# Altium schematic sheet Prac_1.SchDoc
size A3
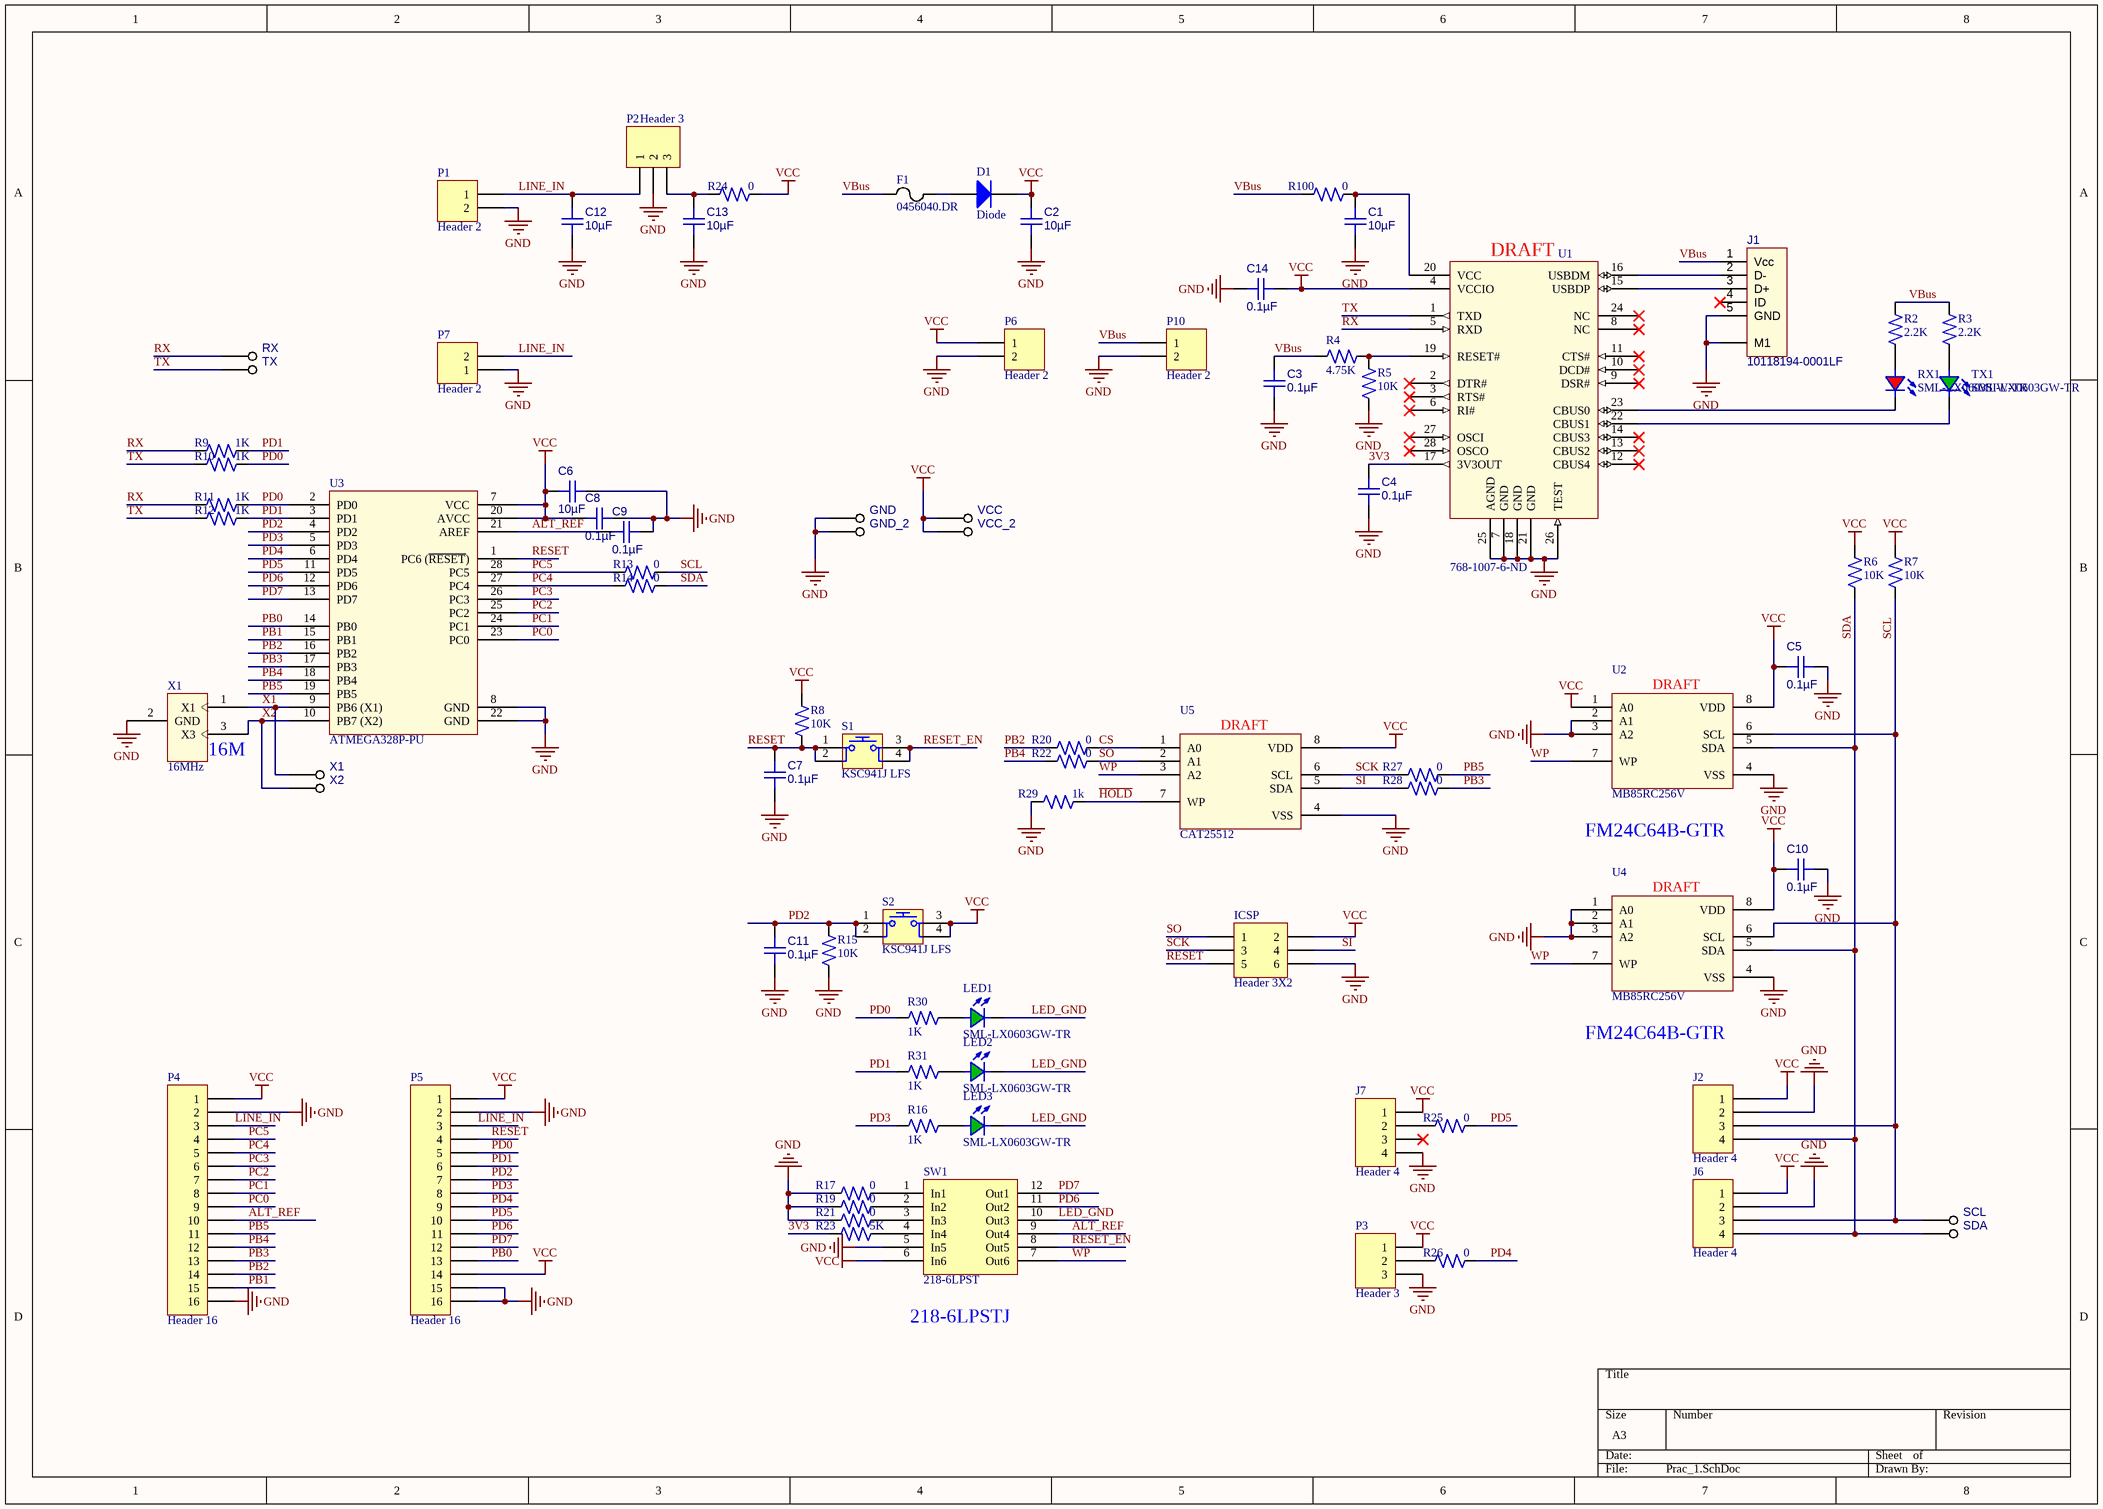
[diagram p0: Prac_1.SchDoc]

## Parts
(Parts that share a designator on the sheet are numbered #1, #2 ... from top to bottom, then left to right.)
C1  10µF  [C0603(0.8)]
C2  10µF  [C0603(0.8)]
C3  0.1µF  [C0603(0.8)]
C4  0.1µF  [C0603(0.8)]
C5  0.1µF  [C0603(0.8)]
C6  10µF  [C0603(0.8)]
C7  0.1µF  [C0603(0.8)]
C8  0.1µF  [C0603(0.8)]
C9  0.1µF  [C0603(0.8)]
C10  0.1µF  [C0603(0.8)]
C11  0.1µF  [C0603(0.8)]
C12  10µF  [C0603(0.8)]
C13  10µF  [C0603(0.8)]
C14  0.1µF  [C0603(0.8)]
D1  Diode  [R0402(0.4)]
F1  0456040.DR  [R0402(0.4)]
GND  Test_Pad  [TP-30X50]  (value not drawn)  (no BOM)
GND_2  Test_Pad  [TP-30X50]  (value not drawn)  (no BOM)
ICSP  Header 3X2  [HDR2X3]
J1  10118194-0001LF  [10118194-0001LF[1]]
J2  Header 4  [HDR1X4]
J6  Header 4  [HDR1X4]
J7  Header 4  [HDR1X4]
LED1  SML-LX0603GW-TR  [SML-LX0603GW-TR]
LED2  SML-LX0603GW-TR  [SML-LX0603GW-TR]
LED3  SML-LX0603GW-TR  [SML-LX0603GW-TR]
P1  Header 2  [jack]
P2  Header 3  [TO-220-3]
P3  Header 3  [HDR1X3]
P4  Header 16  [HDR1X16]
P5  Header 16  [HDR1X16]
P6  Header 2  [HDR1X2]
P7  Header 2  [HDR1X2]
P10  Header 2  [HDR1X2]
R2  2.2K  [R0402(0.4)]
R3  2.2K  [R0402(0.4)]
R4  4.75K  [R0402(0.4)]
R5  10K  [R0402(0.4)]
R6  10K  [R0402(0.4)]
R7  10K  [R0402(0.4)]
R8  10K  [R0402(0.4)]
R9  1K  [R0402(0.4)]
R10  1K  [R0402(0.4)]
R11  1K  [R0402(0.4)]
R12  1K  [R0402(0.4)]
R13  0  [R0402(0.4)]
R14  0  [R0402(0.4)]
R15  10K  [R0402(0.4)]
R16  1K  [R0402(0.4)]
R17  0  [R0402(0.4)]
R19  0  [R0402(0.4)]
R20  0  [R0402(0.4)]
R21  0  [R0402(0.4)]
R22  0  [R0402(0.4)]
R23  5K  [R0402(0.4)]
R24  0  [R0402(0.4)]
R25  0  [R0402(0.4)]
R26  0  [R0402(0.4)]
R27  0  [R0402(0.4)]
R28  0  [R0402(0.4)]
R29  1k  [R0402(0.4)]
R30  1K  [R0402(0.4)]
R31  1K  [R0402(0.4)]
R100  0  [R0402(0.4)]
RX  Test_Pad  [TP-30X50]  (value not drawn)  (no BOM)
RX1  SML-LX0603SIW-TR  [SML-LX0603SIW-TR]
S1  KSC941J LFS  [KSC9(6.5,6.5,7.9)[1]]
S2  KSC941J LFS  [KSC9(6.5,6.5,7.9)[1]]
SCL  Test_Pad  [TP-30X50]  (value not drawn)  (no BOM)
SDA  Test_Pad  [TP-30X50]  (value not drawn)  (no BOM)
SW1  218-6LPST  [218-6LPST]
TX  Test_Pad  [TP-30X50]  (value not drawn)  (no BOM)
TX1  SML-LX0603GW-TR  [SML-LX0603GW-TR]
U1  768-1007-6-ND  [28-SSOP]
U2  MB85RC256V  [MB85RC256V]
U3  ATMEGA328P-PU  [dip28]
U4  MB85RC256V  [MB85RC256V]
U5  CAT25512  [MB85RC256V]
VCC  Test_Pad  [TP-30X50]  (value not drawn)  (no BOM)
VCC_2  Test_Pad  [TP-30X50]  (value not drawn)  (no BOM)
X1#1  16MHz  [ZTT16.00MX]
X1#2  Test_Pad  [TP-30X50]  (value not drawn)  (no BOM)
X2  Test_Pad  [TP-30X50]  (value not drawn)  (no BOM)

## Nets
GND: C1.1 C2.1 C3.1 C4.1 C5.2 C6.1 C7.1 C8.2 C9.2 C10.2 C11.1 C12.1 C13.1 C14.1 GND.1 GND_2.1 ICSP.6 J1.5(GND) J1.M1 J2.2 J6.2 J7.4 P1.2 P2.2 P3.3 P4.2 P4.16 P5.2 P5.15 P5.16 P6.2 P7.1 P10.2 R5.1 R15.1 R17.1 R19.1 R21.1 R29.1 SW1.5(In5) U1.7(GND) U1.18(GND) U1.21(GND) U1.25(AGND) U1.26(TEST) U2.2(A1) U2.3(A2) U2.4(VSS) U3.8(GND) U3.22(GND) U4.1(A0) U4.2(A1) U4.3(A2) U4.4(VSS) U5.4(VSS) X1#1.2(GND)
VCC: C2.2 C5.1 C6.2 C8.1 C10.1 C14.2 D1.2(K) ICSP.2 J2.1 J6.1 J7.1 P3.1 P4.1 P5.1 P5.14 P6.1 R6.2 R7.2 R8.2 R24.2 S2.3 S2.4 SW1.6(In6) U1.4(VCCIO) U2.1(A0) U2.8(VDD) U3.7(VCC) U3.20(AVCC) U4.8(VDD) U5.8(VDD) VCC.1 VCC_2.1
3V3: C4.2 R23.1 U1.17(3V3OUT)
ALT_REF: C9.1 P4.10 SW1.9(Out4) U3.21(AREF)
CS: R20.2 U5.1(A0)
~{HOLD}: R29.2 U5.7(WP)
LED_GND: LED1.2(K) LED2.2(K) LED3.2(K) SW1.10(Out3)
LINE_IN: C12.2 P1.1 P2.1 P4.3 P5.3 P7.2
PB0: P5.13 U3.14(PB0)
PB1: P4.15 U3.15(PB1)
PB2: P4.14 R20.1 U3.16(PB2)
PB3: P4.13 R28.2 U3.17(PB3)
PB4: P4.12 R22.1 U3.18(PB4)
PB5: P4.11 R27.2 U3.19(PB5)
PC0: P4.9 U3.23(PC0)
PC1: P4.8 U3.24(PC1)
PC2: P4.7 U3.25(PC2)
PC3: P4.6 U3.26(PC3)
PC4: P4.5 R14.1 U3.27(PC4)
PC5: P4.4 R13.1 U3.28(PC5)
PD0: P5.5 R10.2 R11.2 R30.1 U3.2(PD0)
PD1: P5.6 R9.2 R12.2 R31.1 U3.3(PD1)
PD2: C11.2 P5.7 R15.2 S2.1 S2.2 U3.4(PD2)
PD3: P5.8 R16.1 U3.5(PD3)
PD4: P5.9 R26.2 U3.6(PD4)
PD5: P5.10 R25.2 U3.11(PD5)
PD6: P5.11 SW1.11(Out2) U3.12(PD6)
PD7: P5.12 SW1.12(Out1) U3.13(PD7)
RESET: C7.2 ICSP.5 P5.4 R8.1 S1.1 S1.2 U3.1(PC6_(~{RESET}))
RESET_EN: S1.3 S1.4 SW1.8(Out5)
RX: R9.1 R11.1 RX.1 U1.5(RXD)
SCK: ICSP.3 R27.1 U5.6(SCL)
SCL: J2.3 J6.3 R7.1 R13.2 SCL.1 U2.6(SCL) U4.6(SCL)
SDA: J2.4 J6.4 R6.1 R14.2 SDA.1 U2.5(SDA) U4.5(SDA)
SI: ICSP.4 R28.1 U5.5(SDA)
SO: ICSP.1 R22.2 U5.2(A1)
TX: R10.1 R12.1 TX.1 U1.1(TXD)
VBus: C3.2 F1.1 J1.1(Vcc) P10.1 R2.2 R3.2 R4.1 R100.1
WP: SW1.7(Out6) U2.7(WP) U4.7(WP) U5.3(A2)
X1: U3.9(PB6_(X1)) X1#1.1(X1) X1#2.1
X2: U3.10(PB7_(X2)) X1#1.3(X3) X2.1
NetC1_2: C1.2 R100.2 U1.20(VCC)
NetC13_2: C13.2 P2.3 R24.1
NetD1_1: D1.1(A) F1.2
NetJ1_2: J1.2(D-) U1.16(USBDM)
NetJ1_3: J1.3(D+) U1.15(USBDP)
NetJ7_2: J7.2 R25.1
NetLED1_1: LED1.1(A) R30.2
NetLED2_1: LED2.1(A) R31.2
NetLED3_1: LED3.1(A) R16.2
NetP3_2: P3.2 R26.1
NetR2_1: R2.1 RX1.1(A)
NetR3_1: R3.1 TX1.1(A)
NetR4_2: R4.2 R5.2 U1.19(RESET#)
NetR17_2: R17.2 SW1.1(In1)
NetR19_2: R19.2 SW1.2(In2)
NetR21_2: R21.2 SW1.3(In3)
NetR23_2: R23.2 SW1.4(In4)
NetRX1_2: RX1.2(K) U1.23(CBUS0)
NetTX1_2: TX1.2(K) U1.22(CBUS1)

Not connected (* = marked no-connect by the designer): J1 4(ID)*; J7 3*; U1 2(DTR#)* 3(RTS#)* 6(RI#)* 8(NC)* 9(DSR#)* 10(DCD#)* 11(CTS#)* 12(CBUS4)* 13(CBUS2)* 14(CBUS3)* 24(NC)* 27(OSCI)* 28(OSCO)*

## Notes on the sheet
- FM24C64B-GTR
- (near SW1) 218-6LPSTJ
- (in symbol FT232RL) DRAFT
- (in symbol MB85RC256V) DRAFT
- (in symbol ZTT16.00MX) 16M

## Library data of the parts
C1 C2 C6 C12 C13 = C1608X5R1E106M080AC: CAP CER 10µF 25V X5R 0603; Manufacturer: TDK Corporation; Tolerance: ±20%; Sub Category: Ceramic Capacitors; Case: 0603; Temperature Coefficient: X5R; Voltage - Rated: 25V; Manufacturer Part Number: C1608X5R1E106M080AC; Category: Capacitors; Part Status: Active; Series: C; Capacitance: 10µF; Operating Temperature: -55°C ~ 85°C; Features: Low ESL; Applications: General Purpose; Mounting Type: Surface Mount, MLCC; Package / Case: 0603 (1608 Metric); Size / Dimension: 0.063" L x 0.032" W (1.60mm x 0.80mm); Thickness (Max): 0.039" (1.00mm); ComponentLink1Description: Datasheet - Mfg. site; ComponentLink1URL: https://product.tdk.com/info/en/catalog/datasheets/mlcc_commercial_general_en.pdf; Supplier 1: Digi-Key; Supplier Part Number 1: 445-9015-1-ND
C3-C5 C7-C11 C14 = GRM188R71H104KA93D: CAP CER 0.1µF 50V X7R 0603; Manufacturer: Murata Electronics North America; Tolerance: ±10%; Sub Category: Ceramic Capacitors; Case: 0603; Temperature Coefficient: X7R; Voltage - Rated: 50V; Manufacturer Part Number: GRM188R71H104KA93D; Category: Capacitors; Part Status: Active; Series: GRM; Capacitance: 0.1µF; Operating Temperature: -55°C ~ 125°C; Applications: General Purpose; Mounting Type: Surface Mount, MLCC; Package / Case: 0603 (1608 Metric); Size / Dimension: 0.063" L x 0.032" W (1.60mm x 0.80mm); Thickness (Max): 0.035" (0.90mm); ComponentLink1Description: Datasheet - Mfg. site; ComponentLink1URL: http://www.murata.com/~/media/webrenewal/support/library/catalog/products/capacitor/mlcc/c02e.ashx?la=en-us; Supplier 1: Digi-Key; Supplier Part Number 1: 490-1519-1-ND
D1 = Diode: Default Diode; Published: 8-Jun-2000; LatestRevisionDate: 17-Jul-2002; LatestRevisionNote: Re-released for DXP Platform.; PackageVersion: Sep-1996; PackageReference: SMC; Publisher: Altium Limited; PackageDescription: DO-214-AB/SMC; 2 C-Bend Leads; Body 7.9 x 5.9 mm, inc. leads (LxW); Code_JEDEC: DO-214-AB
F1 = 0456040.DR: Imported; Vendor: Littelfuse Inc; Built_By: EMA_UL_Team; Type: DEV; C: Copyright (C) 2015 Accelerated Designs. All rights reserved; Manufacturer_Part_Number: 0456040.DR; RefDes: RefDes; Value: Value
GND GND_2 RX SCL SDA TX VCC VCC_2 X1#2 X2 = TP30x50: TP 30X50; Categories: Miscellaneous; Sub Category: Test Pads; Detailed Description: Test Pad 30x50; Manufacturer Part Number: TP30x50
ICSP = Header 3X2: Header, 3-Pin, Dual row; LatestRevisionDate: 17-Jul-2002; LatestRevisionNote: Re-released for DXP Platform.; Publisher: Altium Limited
J1 = 10118194-0001LF: CONN RCPT USB2.0 MICRO B SMD R/A; Manufacturer: Amphenol FCI; Sub Category: USB, DVI, HDMI Connectors; Detailed Description: USB - micro B USB 2.0 Receptacle Connector 5 Position Surface Mount, Right Angle; Through Hole; Connector Type: USB - micro B; Gender: Receptacle; Number of Contacts: 5; Current Rating: 1.8A per Contact; Voltage Rating: 100VAC; Shielding: Shielded; Mating Cycles: 10000; Material Flammability Rating: UL94 V-0; Manufacturer Part Number: 10118194-0001LF; Category: Connectors, Interconnects; Part Status: Active; Specifications: USB 2.0; Mounting Type: Surface Mount, Right Angle; Through Hole; Mounting Feature: Horizontal; Termination: Solder; Features: Solder Retention; Contact Finish: Gold; Insulation Color: Black; Shell/Shielding Material: Steel, Stainless; Operating Temperature: -30°C ~ 80°C; ComponentLink1Description: Datasheet - Mfg. site; ComponentLink1URL: http://www.amphenol-icc.com/media/wysiwyg/files/drawing/10118194.pdf; Supplier 1: Digi-Key; Supplier Part Number 1: 609-4618-1-ND
J2 J6 J7 = Header 4: Header, 4-Pin; LatestRevisionDate: 17-Jul-2002; LatestRevisionNote: Re-released for DXP Platform.; Publisher: Altium Limited
LED1-LED3 TX1 = SML-LX0603GW-TR: LED GREEN DIFFUSED SMD; Manufacturer: Lumex Opto/Components Inc.; Sub Category: LED Indication - Discrete; Detailed Description: Green  LED Indication - Discrete 2.2V 0603 (1608 Metric); Configuration: Standard; Lens Color: White; Millicandela Rating: 18mcd; Lens Style: Rectangle with Flat Top; Lens Size: 1.00mm x 0.80mm; Voltage - Forward (Vf) (Typ): 2.2V; Current - Test: 20mA; Viewing Angle: 160°; Manufacturer Part Number: SML-LX0603GW-TR; Category: Optoelectronics; Part Status: Active; Color: Green; Lens Transparency: Diffused; Mounting Type: Surface Mount; Package / Case: 0603 (1608 Metric); Size / Dimension: 1.60mm L x 0.80mm W; Height (Max): 0.60mm; ComponentLink1Description: Datasheet - Mfg. site; ComponentLink1URL: https://www.lumex.com/content/files/ProductAttachment/SML-LX0603GW-TR.pdf; Supplier 1: Digi-Key; Supplier Part Number 1: 67-1549-1-ND
P1 P6 P7 P10 = Header 2: Header, 2-Pin; LatestRevisionDate: 17-Jul-2002; LatestRevisionNote: Re-released for DXP Platform.; Publisher: Altium Limited
P2 P3 = Header 3: Header, 3-Pin; LatestRevisionDate: 17-Jul-2002; LatestRevisionNote: Re-released for DXP Platform.; Publisher: Altium Limited
P4 P5 = Header 16: Header, 16-Pin; LatestRevisionDate: 17-Jul-2002; LatestRevisionNote: Re-released for DXP Platform.; Publisher: Altium Limited
R2 R3 = ERJ-PA2F2201X: RES SMD 2.2K OHM 1% 1/5W 0402; Manufacturer: Panasonic Electronic Components; Sub Category: Chip Resistor - Surface Mount; Resistance: 2.2 kOhms; Power (Watts): 0.2W, 1/5W; Temperature Coefficient: ±100ppm/°C; Manufacturer Part Number: ERJ-PA2F2201X; Category: Resistor; Part Status: Active; Series: ERJ; Value: 2.2K; Tolerance: ±1%; Composition: Thick Film; Operating Temperature: -55°C ~ 155°C; Features: Automotive AEC-Q200, Pulse Withstanding; Package / Case: 0402 (1005 Metric); Case: 0402; Supplier Device Package: 0402; Size / Dimension: 0.039" L x 0.020" W (1.00mm x 0.50mm); Height - Seated (Max): 0.016" (0.40mm); ComponentLink1Description: Datasheet - Mfg. site; ComponentLink1URL: https://industrial.panasonic.com/cdbs/www-data/pdf/RDO0000/AOA0000C331.pdf; Supplier 1: Digi-Key; Supplier Part Number 1: P17226CT-ND
R4 = AC0402FR-074K75L: RES SMD 4.75K OHM 1% 1/16W 0402; Manufacturer: Yageo; Sub Category: Chip Resistor - Surface Mount; Resistance: 4.75 kOhms; Power (Watts): 0.063W, 1/16W; Temperature Coefficient: ±100ppm/°C; Manufacturer Part Number: AC0402FR-074K75L; Category: Resistor; Part Status: Active; Series: AC; Value: 4.75K; Tolerance: ±1%; Composition: Thick Film; Operating Temperature: -55°C ~ 155°C; Features: Automotive AEC-Q200, Moisture Resistant; Package / Case: 0402 (1005 Metric); Case: 0402; Supplier Device Package: 0402; Size / Dimension: 0.039" L x 0.020" W (1.00mm x 0.50mm); Height - Seated (Max): 0.015" (0.37mm); ComponentLink1Description: Datasheet - Mfg. site; ComponentLink1URL: http://www.yageo.com/NewPortal/yageodocoutput?fileName=/pdf/R-Chip/PYu-AC_51_RoHS_L_6.pdf; Supplier 1: Digi-Key; Supplier Part Number 1: YAG3496CT-ND
R5 R8 R15 = AC0402FR-0710KL: RES SMD 10K OHM 1% 1/16W 0402; Manufacturer: Yageo; Sub Category: Chip Resistor - Surface Mount; Resistance: 10 kOhms; Power (Watts): 0.063W, 1/16W; Temperature Coefficient: ±100ppm/°C; Manufacturer Part Number: AC0402FR-0710KL; Category: Resistor; Part Status: Active; Series: AC; Value: 10K; Tolerance: ±1%; Composition: Thick Film; Operating Temperature: -55°C ~ 155°C; Features: Automotive AEC-Q200, Moisture Resistant; Package / Case: 0402 (1005 Metric); Case: 0402; Supplier Device Package: 0402; Size / Dimension: 0.039" L x 0.020" W (1.00mm x 0.50mm); Height - Seated (Max): 0.015" (0.37mm); ComponentLink1Description: Datasheet - Mfg. site; ComponentLink1URL: http://www.yageo.com/NewPortal/yageodocoutput?fileName=/pdf/R-Chip/PYu-AC_51_RoHS_L_6.pdf; Supplier 1: Digi-Key; Supplier Part Number 1: YAG3436CT-ND
R6 R7 R9-R14 R16 R17 R19-R31 R100 = AC0402FR-071KL: RES SMD 1K OHM 1% 1/16W 0402; Manufacturer: Yageo; Sub Category: Chip Resistor - Surface Mount; Resistance: 1 kOhms; Power (Watts): 0.063W, 1/16W; Temperature Coefficient: ±100ppm/°C; Manufacturer Part Number: AC0402FR-071KL; Category: Resistor; Part Status: Active; Series: AC; Value: 1K; Tolerance: ±1%; Composition: Thick Film; Operating Temperature: -55°C ~ 155°C; Features: Automotive AEC-Q200, Moisture Resistant; Package / Case: 0402 (1005 Metric); Case: 0402; Supplier Device Package: 0402; Size / Dimension: 0.039" L x 0.020" W (1.00mm x 0.50mm); Height - Seated (Max): 0.015" (0.37mm); ComponentLink1Description: Datasheet - Mfg. site; ComponentLink1URL: http://www.yageo.com/NewPortal/yageodocoutput?fileName=/pdf/R-Chip/PYu-AC_51_RoHS_L_6.pdf; Supplier 1: Digi-Key; Supplier Part Number 1: 311-1KLBCT-ND
RX1 = SML-LX0603SIW-TR: LED RED DIFFUSED SMD; Manufacturer: Lumex Opto/Components Inc.; Sub Category: LED Indication - Discrete; Detailed Description: Red  LED Indication - Discrete 2V 0603 (1608 Metric); Configuration: Standard; Lens Color: White; Millicandela Rating: 71.5mcd; Lens Style: Rectangle with Flat Top; Lens Size: 1.00mm x 0.80mm; Voltage - Forward (Vf) (Typ): 2V; Current - Test: 20mA; Viewing Angle: 128°; Manufacturer Part Number: SML-LX0603SIW-TR; Category: Optoelectronics; Part Status: Active; Color: Red; Lens Transparency: Diffused; Mounting Type: Surface Mount; Package / Case: 0603 (1608 Metric); Size / Dimension: 1.60mm L x 0.80mm W; Height (Max): 0.60mm; ComponentLink1Description: Datasheet - Mfg. site; ComponentLink1URL: https://www.lumex.com/content/files/ProductAttachment/SML-LX0603SIW-TR.pdf; Supplier 1: Digi-Key; Supplier Part Number 1: 67-1690-1-ND
S1 S2 = KSC941J LFS: SWITCH TACTILE SPST-NO 0.05A 32V; Manufacturer: C&K; Sub Category: Tactile Switches; Detailed Description: Tactile Switch SPST-NO Top Actuated Surface Mount; Number of Positions: 1; Switch Function: Off-Mom; Contact Rating @ Voltage: 0.05A @ 32VDC; Actuator Type: Plunger for Cap; Actuator Height off PCB, Vertical: 7.70mm; Actuator Orientation: Top Actuated; Outline: 6.20mm x 6.20mm; Manufacturer Part Number: KSC941J LFS; Category: Switches; Part Status: Active; Series: KSC9; Value: KSC941J LFS; Circuit: SPST-NO; Mounting Type: Surface Mount / J Lead; ComponentLink1Description: Datasheet - Mfg. site; ComponentLink1URL: https://www.ckswitches.com/media/1459/ksc.pdf; Supplier 1: Digi-Key; Supplier Part Number 1: CKN10433CT-ND
SW1 = 218-6LPST: SWITCH SLIDE DIP SPST 25MA 24V; Manufacturer: CTS Electrocomponents; Sub Category: DIP Switches; Detailed Description: Dip Switch SPST 6 Position Surface Mount Slide (Standard) Actuator 25mA 24VDC; Number of Positions: 6; Actuator Type: Slide (Standard); Outline: 8.64mm x 8.79mm; Manufacturer Part Number: 218-6LPST; Category: Switches; Part Status: Active; Series: 218; Value: 218-6LPST; Circuit: SPST; Contact Rating @ Voltage: 25mA; Mounting Type: Surface Mount; Operating Temperature: -55°C ~ 85°C; ComponentLink1Description: Datasheet - Mfg. site; ComponentLink1URL: https://www.ctscorp.com/wp-content/uploads/218.pdf; Supplier 1: Digi-Key; Supplier Part Number 1: CT2186LPST-ND
U1 = FT232RL: IC USB FS SERIAL UART 28-SSOP; Manufacturer: FTDI; Sub Category: UART-USB IC; Detailed Description: USB Bridge, USB to UART USB 2.0 UART Interface 28-SSOP; Supply Voltage: 3.3V ~ 5.25V; Manufacturer Part Number: FT232RL; Category: Integrated Circuits (ICs); Part Status: Active; Value: 768-1007-6-ND; Series: USBmadeEZ-UART; Operating Temperature: -40°C ~ 85°C; Package / Case: 28-SSOP; Supplier Device Package: 28-SSOP; ComponentLink1Description: Datasheet - Mfg. site; ComponentLink1URL: https://www.ftdichip.com/Support/Documents/DataSheets/ICs/DS_FT232R.pdf; Supplier 1: Digi-Key; Supplier Part Number 1: 768-1007-6-ND
U2 U4 U5 = MB85RC256V: IC FRAM 256KBIT I2C 1MHZ 8SOP; Manufacturer: FUJITSU SEMICONDUCTOR; ID: 653; Sub Category: Memory FRAM; Supply Voltage: 2.7 V to 5.5 V; Manufacturer Part Number: MB85RC256V; Category: Integrated Circuits (ICs); Detailed Description: IC FRAM 256KBIT I2C 1MHZ 8SOP; Part Status: Active; Value: MB85RC256V; Series: MB85RC; Primary Attributes: I2C; Operating Temperature: -40°C ~ 85°C; Package / Case: SOP-8; Supplier Device Package: FPT-8P-M02/8; Size / Dimension: 6mmx5mm; Height - Seated (Max): 1.6mm; ComponentLink1Description: Datasheet - Mfg. site; ComponentLink1URL: https://www.fujitsu.com/us/Images/MB85RC256V-DS501-00017-3v0-E.pdf; Supplier 1: Digi-Key; Supplier Part Number 1: 865-1249-1-ND
X1#1 = ZTT16.00MX: 16 MHz Ceramic Resonator / Oscillator; Manufacturer: ECS; Frequency Stability: 0.30%; Frequency Tolerance: 0.50%; Load Capacitance: 30 pF; Manufacturer Part Number: ZTT16.00MX; Category: Crystals, Oscillators, Resonators; Sub Category: Resonator / Oscillator; Detailed Description: 16 MHz Ceramic Resonator / Oscillator; Part Status: Active; Series: ZZT; Type: MHz Oscillator; Frequency: 16MHz; Operating Temperature: -20~ +80°C; Mounting Type: Through Hole; Height - Seated (Max): 7.5mm; ComponentLink1Description: Datasheet - Mfg. site; ComponentLink1URL: https://www.mouser.com/datasheet/2/122/zttr-19738.pdf; Supplier 1: Mouser; Supplier Part Number 1: 520-ZTT1600MX